# Altium schematic sheet Microcontroller.SchDoc
size A3; ApprovedBy: Enes Mercan; CompanyName: HurSAT; Engineer: Enes Mercan; SheetNumber: 4; SheetTotal: 5; PageSize: A3
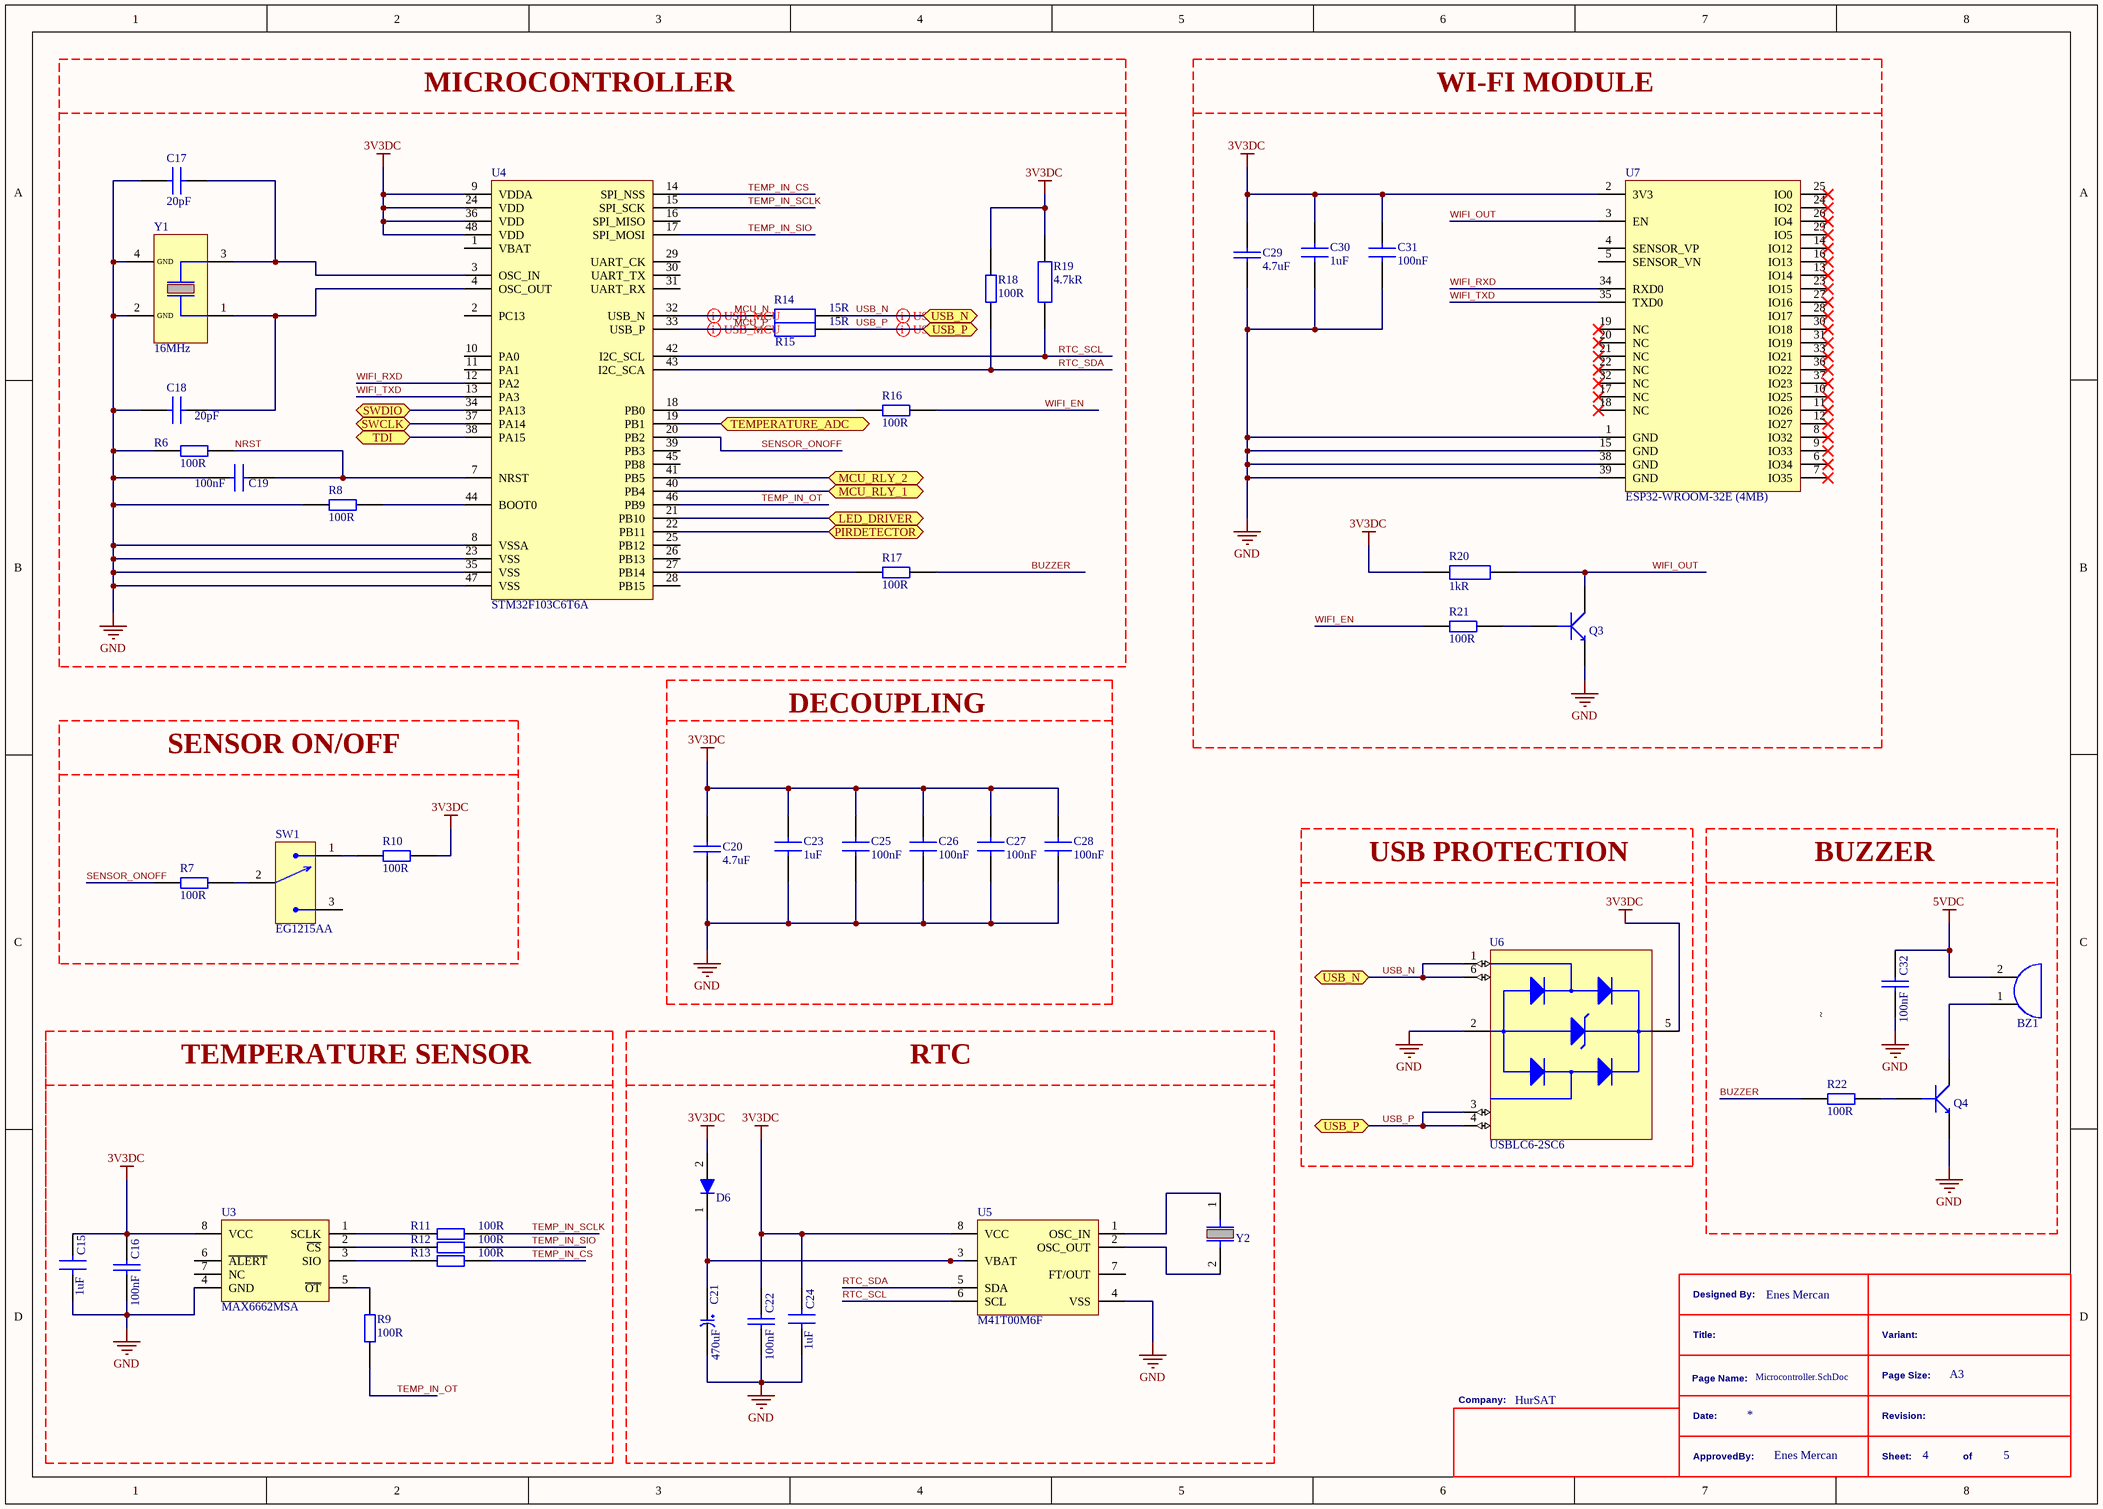
[diagram p0: Microcontroller.SchDoc]

## Parts
BZ1  CMI-9605IC-0580T  [CMI-9605IC-0580T]  (value not drawn)
C15  Capacitance: 1uF  [CAP_0805]  (hidden comment: CL21B105KBFNNNE)
C16  Capacitance: 100nF  [CAP_0805]  (hidden comment: CL21B104KBCNNNC)
C17  Capacitance: 20pF  [cap_0603]  (hidden comment: CL10C200JB8NNNC)
C18  Capacitance: 20pF  [cap_0603]  (hidden comment: CL10C200JB8NNNC)
C19  Capacitance: 100nF  [cap_0603]  (hidden comment: C0603X104K4RACTU)
C20  Capacitance: 4.7uF  [CAP_0805]  (hidden comment: CL21A475KAQNNNE)
C21  Capacitance: 470uF  [CAP_RADIAL_D10P5]  (hidden comment: ESY277M050AH4AA)
C22  Capacitance: 100nF  [CAP_0805]  (hidden comment: CL21B104KBCNNNC)
C23  Capacitance: 1uF  [CAP_0805]  (hidden comment: CL21B105KBFNNNE)
C24  Capacitance: 1uF  [CAP_0805]  (hidden comment: CL21B105KBFNNNE)
C25  Capacitance: 100nF  [cap_0603]  (hidden comment: C0603X104K4RACTU)
C26  Capacitance: 100nF  [cap_0603]  (hidden comment: C0603X104K4RACTU)
C27  Capacitance: 100nF  [cap_0603]  (hidden comment: C0603X104K4RACTU)
C28  Capacitance: 100nF  [cap_0603]  (hidden comment: C0603X104K4RACTU)
C29  Capacitance: 4.7uF  [CAP_0805]  (hidden comment: CL21A475KAQNNNE)
C30  Capacitance: 1uF  [CAP_0805]  (hidden comment: CL21B105KBFNNNE)
C31  Capacitance: 100nF  [cap_0603]  (hidden comment: C0603X104K4RACTU)
C32  Capacitance: 100nF  [CAP_0805]  (hidden comment: CL21B104KBCNNNC)
D6  1N4148WS  [1N4148WS]  (value not drawn)
Q3  MMBT3904-7-F  [MMBT3904-7-F]  (value not drawn)
Q4  MMBT3904-7-F  [MMBT3904-7-F]  (value not drawn)
R6  Resistance: 100R  [res_0603]  (hidden comment: RE0603DRE07100RL)
R7  Resistance: 100R  [res_0603]  (hidden comment: RE0603DRE07100RL)
R8  Resistance: 100R  [res_0603]  (hidden comment: RE0603DRE07100RL)
R9  Resistance: 100R  [res_0603]  (hidden comment: RE0603DRE07100RL)
R10  Resistance: 100R  [res_0603]  (hidden comment: RE0603DRE07100RL)
R11  Resistance: 100R  [res_0603]  (hidden comment: RE0603DRE07100RL)
R12  Resistance: 100R  [res_0603]  (hidden comment: RE0603DRE07100RL)
R13  Resistance: 100R  [res_0603]  (hidden comment: RE0603DRE07100RL)
R14  Resistance: 15R  [res_0603]  (hidden comment: RT0603WRE0715RL)
R15  Resistance: 15R  [res_0603]  (hidden comment: RT0603WRE0715RL)
R16  Resistance: 100R  [res_0603]  (hidden comment: RE0603DRE07100RL)
R17  Resistance: 100R  [res_0603]  (hidden comment: RE0603DRE07100RL)
R18  Resistance: 100R  [res_0603]  (hidden comment: RE0603DRE07100RL)
R19  Resistance: 4.7kR  [res_0603]  (hidden comment: RT0603BRB074K7L)
R20  Resistance: 1kR  [res_0603]  (hidden comment: AC0603FR-071KL)
R21  Resistance: 100R  [res_0603]  (hidden comment: RE0603DRE07100RL)
R22  Resistance: 100R  [res_0603]  (hidden comment: RE0603DRE07100RL)
SW1  EG1215AA  [EG1215AA]
U3  MAX6662MSA  [SOIC8]
U4  STM32F103C6T6A  [LQFP-48]
U5  M41T00M6F  [SOIC8]
U6  USBLC6-2SC6  [SOT23-6L]
U7  ESP32-WROOM-32E (4MB)  [ESP32-32E]
Y1  Frequency: 16MHz  [ECS]  (hidden comment: ECS-160-20-30B-TR)
Y2  CRYSTAL_32768KHZ  [ABS05]  (value not drawn)

## Blocks framed on the sheet
MICROCONTROLLER: C17-C19 R6 R8 R14-R19 U4 Y1
WI-FI MODULE: C29-C31 Q3 R20 R21 U7
DECOUPLING: C20 C23 C25-C28
SENSOR ON/OFF: R7 R10 SW1
USB PROTECTION: U6
BUZZER: BZ1 C32 Q4 R22
RTC: C21 C22 C24 D6 U5 Y2

## Ports
LED_DRIVER (bidir), MCU_RLY_1 (bidir), MCU_RLY_2 (bidir), PIRDETECTOR (bidir), SWCLK (bidir), SWDIO (bidir), TDI (bidir), TEMPERATURE_ADC (bidir), USB_N (bidir), USB_P (bidir)

## Nets
3V3DC: C15.2 C16.2 C20.2 C22.2 C23.2 C24.2 C25.2 C26.2 C27.2 C28.2 C29.2 C30.2 C31.2 D6.2 R10.2 R18.2 R19.2 R20.1 U3.8(VCC) U4.9(VDDA) U4.24(VDD) U4.36(VDD) U4.48(VDD) U5.8(VCC) U6.5(VBUS) U7.2(3V3)
5VDC: BZ1.2 C32.2
GND: C15.1 C16.1 C17.1 C18.1 C19.2 C20.1 C21.2 C22.1 C23.1 C24.1 C25.1 C26.1 C27.1 C28.1 C29.1 C30.1 C31.1 C32.1 Q3.E Q4.E R6.1 R8.1 U3.4(GND) U4.8(VSSA) U4.23(VSS) U4.35(VSS) U4.47(VSS) U5.4(VSS) U6.2(GND) U7.1(GND) U7.15(GND) U7.38(GND) U7.39(GND) Y1.2(GND) Y1.4(GND)
BUZZER: R17.2 R22.1
LED_DRIVER: U4.21(PB10) ; port LED_DRIVER
MCU_N: R14.1 U4.32(USB_N)
MCU_P: R15.1 U4.33(USB_P)
MCU_RLY_1: U4.40(PB4) ; port MCU_RLY_1
MCU_RLY_2: U4.41(PB5) ; port MCU_RLY_2
NRST: C19.1 R6.2 U4.7(NRST)
PIRDETECTOR: U4.22(PB11) ; port PIRDETECTOR
RTC_SCL: R19.1 U4.42(I2C_SCL) U5.6(SCL)
RTC_SDA: R18.1 U4.43(I2C_SCA) U5.5(SDA)
SENSOR_ONOFF: R7.1 U4.20(PB2)
SWCLK: U4.37(PA14) ; port SWCLK
SWDIO: U4.34(PA13) ; port SWDIO
TDI: U4.38(PA15) ; port TDI
TEMP_IN_CS: R13.2 U4.14(SPI_NSS)
TEMP_IN_OT: R9.2 U4.46(PB9)
TEMP_IN_SCLK: R11.2 U4.15(SPI_SCK)
TEMP_IN_SIO: R12.2 U4.17(SPI_MOSI)
TEMPERATURE_ADC: U4.19(PB1) ; port TEMPERATURE_ADC
USB_N: R14.2 U6.1(I/O1) U6.6(I/O1) ; port USB_N
USB_P: R15.2 U6.3(I/O2) U6.4(I/O2) ; port USB_P
WIFI_EN: R16.2 R21.1
WIFI_OUT: Q3.C R20.2 U7.3(EN)
WIFI_RXD: U4.12(PA2) U7.34(RXD0)
WIFI_TXD: U4.13(PA3) U7.35(TXD0)
NetBZ1_1: BZ1.1 Q4.C
NetC17_2: C17.2 U4.3(OSC_IN) Y1.3
NetC18_2: C18.2 U4.4(OSC_OUT) Y1.1
NetC21_1: C21.1 D6.1 U5.3(VBAT)
NetQ3_B: Q3.B R21.2
NetQ4_B: Q4.B R22.2
NetR7_2: R7.2 SW1.2
NetR8_2: R8.2 U4.44(BOOT0)
NetR9_1: R9.1 U3.5(~{OT})
NetR10_1: R10.1 SW1.1
NetR11_1: R11.1 U3.1(SCLK)
NetR12_1: R12.1 U3.2(~{CS})
NetR13_1: R13.1 U3.3(SIO)
NetR16_1: R16.1 U4.18(PB0)
NetR17_1: R17.1 U4.27(PB14)
NetU5_1: U5.1(OSC_IN) Y2.1
NetU5_2: U5.2(OSC_OUT) Y2.2

Not connected (* = marked no-connect by the designer): SW1 3; U3 6(~{ALERT}) 7(NC); U4 1(VBAT) 2(PC13) 10(PA0) 11(PA1) 16(SPI_MISO) 25(PB12) 26(PB13) 28(PB15) 29(UART_CK) 30(UART_TX) 31(UART_RX) 39(PB3) 45(PB8); U5 7(FT/OUT); U7 4(SENSOR_VP) 5(SENSOR_VN) 6(IO34)* 7(IO35)* 8(IO32)* 9(IO33)* 10(IO25)* 11(IO26)* 12(IO27)* 13(IO14)* 14(IO12)* 16(IO13)* 17(NC)* 18(NC)* 19(NC)* 20(NC)* 21(NC)* 22(NC)* 23(IO15)* 24(IO2)* 25(IO0)* 26(IO4)* 27(IO16)* 28(IO17)* 29(IO5)* 30(IO18)* 31(IO19)* 32(NC)* 33(IO21)* 36(IO22)* 37(IO23)*

## Layout directives
differential pair: MCU_N, MCU_P, USB_N, USB_P

## Notes on the sheet
- TEMPERATURE SENSOR
- ~
- Designed By:
- Page Name:
- Title:
- Variant:
- Page Size:
- Company:
- ApprovedBy:
- Date:
- Sheet:
- Revision:
- of

## Library data of the parts
BZ1 = CMI-9605IC-0580T: Buzzers Indicator, Internally Driven Magnetic 5 V 30mA 2.7kHz 80dB @ 5V, 10cm Through Hole PC Pins; Manufacturer: CUI Devices; designedBy: ENES; Supplier 1: Digi-Key; Manufacturer Part Number: CMI-9605IC-0580T; RoHS: No; Stock 1: 1487; Pricing 1: 1=1.56000, 10=1.17900, 25=1.09080, 50=1.02680, 100=0.96490, 500=0.83018, 1000=0.77805 (USD); Supplier Part Number 1: 2223-CMI-9605IC-0580T-ND; Case/Package: CMI-9605IC
C15 C23 C24 C30 = CAP CER 1uF 0805: SAMSUNG ELECTRO-MECHANICS - CL21B105KBFNNNE - SMD Multilayer Ceramic Capacitor, 1 µF, 50 V, 0805 [2012 Metric], ± 10%, X7R, CL Series; Voltage Rating: 50V; Supplier 1: Newark; Manufacturer: Samsung; Manufacturer Part Number: CL21B105KBFNNNE; RoHS: Yes; Category: Ceramic Capacitors; Stock 1: 742; Pricing 1: 1=0.16300, 10=0.11300, 25=0.08900, 50=0.06400, 100=0.05300 (USD); Mount: Surface Mount; Case/Package: 0805; Case Code (Metric): 2012; Case Code (Imperial): 0805; Min Operating Temperature: -55°C; Max Operating Temperature: 125°C; Tolerance: 10%; Packaging: Tape and Reel; Package Quantity: 1; Dielectric: X7R; Voltage: 50V; Series: CL; Construction: Flat; Length: 2mm; Width: 0.049inch; Height: 1.25mm; Thickness: 0.053inch; Depth: 1.25mm; Radiation Hardening: No; RoHS Compliant: Yes; ComponentLink1URL: https://datasheet.ciiva.com/25800/cl21b105kbfnnne-25800291.pdf?src-supplier=Digi-Key; ComponentLink1Description: https://datasheet.ciiva.com/25800/cl21b105kbfnnne-25800291.pdf?src-supplier=Digi-Key; ComponentLink2URL: https://datasheet.ciiva.com/16449/cl21b105kbfnnne-16449003.pdf?src-supplier=Future+Electronics; ComponentLink2Description: https://datasheet.ciiva.com/16449/cl21b105kbfnnne-16449003.pdf?src-supplier=Future+Electronics; ComponentLink3URL: https://datasheet.ciiva.com/26838/getdatasheetpartid-354075-26838668.pdf?src-supplier=Verical; ComponentLink3Description: https://datasheet.ciiva.com/26838/getdatasheetpartid-354075-26838668.pdf?src-supplier=Verical; Supplier Part Number 1: 82AC9435
C16 C22 C32 = CAP CER 100nF  0805: CAP CER %10 0805; Manufacturer: Samsung; Material: Ceramic; Tolerance: 10%; Dielectric: X7R; Voltage Rating: 50V; Supplier 1: Digi-Key; Manufacturer Part Number: CL21B104KBCNNNC; RoHS: Yes; Category: Ceramic Capacitors; Stock 1: 1183365; Pricing 1: 1=0.10000, 10=0.04900, 50=0.02680, 100=0.02190, 500=0.01566, 1000=0.01230 (USD); Mount: Surface Mount; Case/Package: 0805; Case Code (Metric): 2012; Case Code (Imperial): 0805; Contact Plating: Tin; Min Operating Temperature: -55°C; Max Operating Temperature: 125°C; Packaging: Tape and Reel; Voltage: 50V; Voltage Rating (DC): 50V; Series: CL; Construction: Flat; Length: 2mm; Width: 0.049inch; Height: 0.85mm; Depth: 1.25mm; Thickness: 0.037inch; Radiation Hardening: No; Lead Free: Lead Free; RoHS Compliant: Yes; ComponentLink1URL: https://datasheet.ciiva.com/25710/cl21b104kbcnnnc-25710182.pdf?src-supplier=Digi-Key; ComponentLink1Description: https://datasheet.ciiva.com/25710/cl21b104kbcnnnc-25710182.pdf?src-supplier=Digi-Key; ComponentLink2URL: https://datasheet.ciiva.com/29199/454152-da-01-en-vs-kondensator-0805-29199814.pdf?src-supplier=Conrad; ComponentLink2Description: https://datasheet.ciiva.com/29199/454152-da-01-en-vs-kondensator-0805-29199814.pdf?src-supplier=Conrad; Supplier Part Number 1: 1276-1003-1-ND
C17 C18 = CAP CER 20pF: SAMSUNG ELECTRO-MECHANICS - CL10C200JB8NNNC - SMD Multilayer Ceramic Capacitor, 20 pF, 50 V, 0603 [1608 Metric], ± 5%, C0G / NP0, CL Series; Voltage Rating: 50V; Temperature Coefficient: 300ppm/°C; Supplier 1: Digi-Key; Manufacturer: Samsung; Manufacturer Part Number: CL10C200JB8NNNC; RoHS: Yes; Category: Ceramic Capacitors; Stock 1: 669806; Pricing 1: 1=0.10000, 10=0.04900, 50=0.02680, 100=0.02180, 500=0.01558, 1000=0.01224 (USD); Mount: Surface Mount; Case/Package: 0603; Case Code (Metric): 1608; Case Code (Imperial): 0603; Min Operating Temperature: -55°C; Max Operating Temperature: 125°C; Tolerance: 5%; Dielectric: C0G; Package Quantity: 1; Packaging: Tape and Reel; Voltage: 50V; Series: CL; Construction: Flat; Length: 1.6mm; Width: 0.031inch; Height: 0.8mm; Thickness: 0.035inch; Depth: 0.8mm; Radiation Hardening: No; RoHS Compliant: Yes; ComponentLink1URL: https://datasheet.ciiva.com/26877/getdatasheetpartid-640634-26877974.pdf?src-supplier=Verical; ComponentLink1Description: https://datasheet.ciiva.com/26877/getdatasheetpartid-640634-26877974.pdf?src-supplier=Verical; ComponentLink2URL: https://datasheet.ciiva.com/26310/mlcc-catalogdownload2013-eng-26310315.pdf?src-supplier=Distrelec; ComponentLink2Description: https://datasheet.ciiva.com/26310/mlcc-catalogdownload2013-eng-26310315.pdf?src-supplier=Distrelec; Supplier Part Number 1: 1276-1187-1-ND
C19 C25-C28 C31 = CAP CER 100nF  0603: CAP CER 0.1UF 16V X7R 0603; Manufacturer: KEMET; Dielectric Material: Ceramic; Tolerance: 10%; Dissipation Factor: 3.5%; designedBy: ENES; Supplier 1: Digi-Key; Manufacturer Part Number: C0603X104K4RACTU; RoHS: Yes; Category: Ceramic Capacitors; Stock 1: 7802; Pricing 1: 1=0.42000, 10=0.28900, 50=0.20220, 100=0.17320, 500=0.12994, 1000=0.10972 (USD); Mount: Surface Mount,PCB; Case/Package: 0603; Number of Pins: 2; Case Code (Metric): 1608; Case Code (Imperial): 0603; Min Operating Temperature: -55°C; Max Operating Temperature: 125°C; Package Quantity: 4000; Voltage Rating: 16V; Packaging: Tape and Reel; Voltage Rating (DC): 16V; Dielectric: X7R; Termination: SMD/SMT; Voltage: 16V; Features: Soft Termination; Length: 1.6mm; Width: 0.8mm; Height: 0.8mm; Thickness: 0.034inch; Depth: 0.8mm; Radiation Hardening: No; REACH SVHC: No SVHC; ComponentLink1URL: https://datasheet.ciiva.com/14597/70096394-14597397.pdf?src-supplier=Allied+Electronics; ComponentLink1Description: https://datasheet.ciiva.com/14597/70096394-14597397.pdf?src-supplier=Allied+Electronics; ComponentLink2URL: https://datasheet.ciiva.com/14594/70096394-14594795.pdf?src-supplier=Allied+Electronics; ComponentLink2Description: https://datasheet.ciiva.com/14594/70096394-14594795.pdf?src-supplier=Allied+Electronics; Supplier Part Number 1: 399-5344-1-ND
C20 C29 = CAP CER 4.7uF 0805: CAP CER 4.7uF %10 0805; Manufacturer: Samsung; Tolerance: 10%; Voltage Rating: 25V; Dielectric: X5R; Supplier 1: Arrow Electronics; Manufacturer Part Number: CL21A475KAQNNNE; RoHS: Yes; Category: Ceramic Capacitors; Stock 1: 28; Pricing 1: 1=0.09310, 10=0.05730, 25=0.05670 (USD); Mount: Surface Mount; Case/Package: 0805; Case Code (Metric): 2012; Case Code (Imperial): 0805; Min Operating Temperature: -55°C; Max Operating Temperature: 85°C; Package Quantity: 1; Packaging: Tape and Reel; Voltage Rating (DC): 25V; Series: CL; Construction: Flat; Length: 2mm; Width: 0.049inch; Height: 1.25mm; Thickness: 0.055inch; Depth: 1.25mm; Radiation Hardening: No; Lead Free: Lead Free; RoHS Compliant: Yes; ComponentLink1URL: https://datasheet.ciiva.com/25798/cl21a475kaqnnne-25798882.pdf?src-supplier=Digi-Key; ComponentLink1Description: https://datasheet.ciiva.com/25798/cl21a475kaqnnne-25798882.pdf?src-supplier=Digi-Key; Supplier Part Number 1: CL21A475KAQNNNE
C21 = CAP ALU ELEC 470uF: Cap, 470UF, 50V, Alu Elec, Radial; Manufacturer: KEMET; Manufacturer Part Number: ESH477M050AH4AA; Polarity: Polar; Tolerance: 20%; Life (Hours): 2000Hour; Supplier 1: Digi-Key; RoHS: No; Pricing 1: 1=0.59000, 10=0.41700, 50=0.31540, 100=0.27470, 500=0.20350, 1000=0.17298, 2500=0.16280, 5000=0.15262 (USD); Mount: Through Hole; Case/Package: Radial; Min Operating Temperature: -40°C; Max Operating Temperature: 105°C; Packaging: Bulk; Voltage Rating: 50V; RoHS Compliant: No; ComponentLink1URL: https://api.kemet.com/component-edge/download/datasheet/ESH477M050AH4AA.pdf?src-supplier=Digi-Key; ComponentLink1Description: https://api.kemet.com/component-edge/download/datasheet/ESH477M050AH4AA.pdf?src-supplier=Digi-Key; Supplier Part Number 1: 399-15683-ND
D6 = 1N4148WS: ON SEMICONDUCTOR - 1N4148WS - Small Signal Diode, Single, 75 V, 150 mA, 1 V, 4 ns; Manufacturer: ON Semiconductor / Fairchild; Forward Current: 150mA; Max Repetitive Reverse Voltage (Vrrm): 75V; Reverse Recovery Time: 4ns; Forward Voltage: 1V; Max Reverse Current: 5uA; Power Dissipation: 200mW; Max Forward Surge Current (Ifsm): 2A; Supplier 1: Digi-Key; Manufacturer Part Number: 1N4148WS; RoHS: Yes; Category: Rectifier Diodes; Stock 1: 462441; Pricing 1: 1=0.18000, 10=0.16700, 100=0.09090, 500=0.05596, 1000=0.03816 (USD); Mount: Surface Mount; Number of Pins: 2; Contact Plating: Tin,Matte; Weight: 0.0276g; Min Operating Temperature: -55°C; Max Operating Temperature: 150°C; Packaging: Tape and Reel; Element Configuration: Single; Package Quantity: 1; Average Rectified Current: 150mA; Max Reverse Voltage (DC): 75V; Recovery Time: 4ns; Series: -; Reverse Voltage: 75V; Length: 1.8mm; Width: 1.35mm; Height: 1mm; Radiation Hardening: No; RoHS Compliant: Yes; REACH SVHC: No SVHC; Lead Free: Lead Free; ComponentLink1URL: https://datasheet.ciiva.com/25968/1n914bws-25968945.pdf?src-supplier=Avnet+Europe; ComponentLink1Description: https://datasheet.ciiva.com/25968/1n914bws-25968945.pdf?src-supplier=Avnet+Europe; ComponentLink2URL: https://datasheet.ciiva.com/30479/0900766b810e1cd3-30479206.pdf?src-supplier=RSComponents; ComponentLink2Description: https://datasheet.ciiva.com/30479/0900766b810e1cd3-30479206.pdf?src-supplier=RSComponents; ComponentLink3URL: https://datasheet.ciiva.com/8300/1n914bws-8300360.pdf?src-supplier=Avnet; ComponentLink3Description: https://datasheet.ciiva.com/8300/1n914bws-8300360.pdf?src-supplier=Avnet; ComponentLink4URL: https://datasheet.ciiva.com/15208/getdatasheetpartid-127819-15208358.pdf?src-supplier=Verical; ComponentLink4Description: https://datasheet.ciiva.com/15208/getdatasheetpartid-127819-15208358.pdf?src-supplier=Verical; ComponentLink5URL: https://datasheet.ciiva.com/910/1n4148ws-910381.pdf?src-supplier=Digi-Key; ComponentLink5Description: https://datasheet.ciiva.com/910/1n4148ws-910381.pdf?src-supplier=Digi-Key; ComponentLink6URL: https://datasheet.ciiva.com/910/1n4148ws-910382.pdf?src-supplier=Digi-Key; ComponentLink6Description: https://datasheet.ciiva.com/910/1n4148ws-910382.pdf?src-supplier=Digi-Key; ComponentLink7URL: https://datasheet.ciiva.com/910/1n4148ws-910380.pdf?src-supplier=Digi-Key; ComponentLink7Description: https://datasheet.ciiva.com/910/1n4148ws-910380.pdf?src-supplier=Digi-Key; Supplier Part Number 1: 1N4148WSFSCT-ND
Q3 Q4 = MMBT3904-7-F: Transistor General Purpose BJT NPN 40 Volt 0.2A Automotive 3-Pin SOT-23; Manufacturer: Diodes Zetex; Max Power Dissipation: 300mW; Collector Emitter Voltage (VCEO): 40V; Max Collector Current: 200mA; Collector Base Voltage (VCBO): 60V; Frequency: 300MHz; hFE Min: 100; Number of Elements: 1; Emitter Base Voltage (VEBO): 6V; Collector Emitter Saturation Voltage: 300mV; Power Dissipation: 350mW; Element Configuration: Single; Supplier 1: RSComponents; Manufacturer Part Number: MMBT3904-7-F; RoHS: Yes; Category: BJTs; Stock 1: 66000; Pricing 1: 200=0.04800, 1000=0.03300, 2000=0.03000, 5000=0.01600, 10000=0.01600 (USD); Mount: Surface Mount; Case/Package: SOT-23; Number of Pins: 3; Weight: 0.000282oz; Contact Plating: Tin,Matte; Min Operating Temperature: -55°C; Max Operating Temperature: 150°C; Polarity: NPN; Packaging: Tape and Reel; Package Quantity: 3000; Transition Frequency: 300MHz; Collector Emitter Breakdown Voltage: 40V; Max Breakdown Voltage: 40V; Continuous Collector Current: 200mA; Max Frequency: 300MHz; Gain Bandwidth Product: 300MHz; Series: -; Collector-emitter Voltage-Max: 300mV; Voltage Rating (DC): 40V; Length: 3.05mm; Width: 1.4mm; Height: 1mm; Radiation Hardening: No; REACH SVHC: No SVHC; Lead Free: Lead Free; RoHS Compliant: Yes; ComponentLink1URL: https://datasheet.ciiva.com/11201/ds30036-11201778.pdf?src-supplier=Avnet; ComponentLink1Description: https://datasheet.ciiva.com/11201/ds30036-11201778.pdf?src-supplier=Avnet; ComponentLink2URL: https://datasheet.ciiva.com/15138/getdatasheetpartid-53265-15138780.pdf?src-supplier=Verical; ComponentLink2Description: https://datasheet.ciiva.com/15138/getdatasheetpartid-53265-15138780.pdf?src-supplier=Verical; ComponentLink3URL: https://datasheet.ciiva.com/6361/ds30036-6361254.pdf?src-supplier=Digi-Key; ComponentLink3Description: https://datasheet.ciiva.com/6361/ds30036-6361254.pdf?src-supplier=Digi-Key; ComponentLink4URL: https://datasheet.ciiva.com/22711/1915516-22711750.pdf?src-supplier=Element14; ComponentLink4Description: https://datasheet.ciiva.com/22711/1915516-22711750.pdf?src-supplier=Element14; ComponentLink5URL: https://datasheet.ciiva.com/11198/ds30036-11198999.pdf?src-supplier=Avnet; ComponentLink5Description: https://datasheet.ciiva.com/11198/ds30036-11198999.pdf?src-supplier=Avnet; ComponentLink6URL: https://datasheet.ciiva.com/6361/ds30036-6361256.pdf?src-supplier=Digi-Key; ComponentLink6Description: https://datasheet.ciiva.com/6361/ds30036-6361256.pdf?src-supplier=Digi-Key; Supplier Part Number 1: 7385049P
R6-R13 R16-R18 R21 R22 = RES 100 OHM 0603: Chip Resistor Precision Grade Thick Film 0603 100Ohm 0.5% Paper T/R; Manufacturer: Yageo; Max Power Dissipation: 100mW; Temperature Coefficient: 50ppm/°C; Supplier 1: Digi-Key; Manufacturer Part Number: RE0603DRE07100RL; RoHS: Yes; Category: Chip SMD Resistors; Pricing 1: 5000=0.01210 (USD); Case/Package: 0603; Min Operating Temperature: -55°C; Max Operating Temperature: 155°C; Packaging: Tape and Reel; Resistor Type: Thick Film; Number of Terminations: 2; Tolerance: 0.5%; Features: Moisture Resistant; Length: 0.063inch; Width: 0.032inch; Height: 0.022inch; RoHS Compliant: Yes; ComponentLink1URL: http://www.yageo.com/NewPortal/yageodocoutput?fileName=/pdf/R-Chip/PYu-RE_105_RoHS_L_6.pdf&src-supplier=Digi-Key; ComponentLink1Description: http://www.yageo.com/NewPortal/yageodocoutput?fileName=/pdf/R-Chip/PYu-RE_105_RoHS_L_6.pdf&src-supplier=Digi-Key; Supplier Part Number 1: RE0603DRE07100RL-ND
R14 R15 = RES 15 OHM 0603: RES SMD 15 OHM 0.05% 1/10W 0603; Manufacturer: Yageo; Max Power Dissipation: 100mW; Temperature Coefficient: 50ppm/°C; Supplier 1: Digi-Key; Manufacturer Part Number: RT0603WRE0715RL; RoHS: Yes; Category: Chip SMD Resistors; Pricing 1: 5000=0.08031 (USD); Case/Package: 0603; Min Operating Temperature: -55°C; Max Operating Temperature: 155°C; Packaging: Tape and Reel; Resistor Type: Thin Film; Number of Terminations: 2; Tolerance: 0.05%; Features: Moisture Resistant; Length: 0.063inch; Width: 0.031inch; Height: 0.022inch; RoHS Compliant: Yes; ComponentLink1URL: http://www.yageo.com/documents/recent/PYu-RT_1-to-0.01_RoHS_L_8.pdf?src-supplier=Digi-Key; ComponentLink1Description: http://www.yageo.com/documents/recent/PYu-RT_1-to-0.01_RoHS_L_8.pdf?src-supplier=Digi-Key; Supplier Part Number 1: RT0603WRE0715RL-ND
R19 = RES 4K7 OHM 0603: Res Thin Film 0603 4.7K Ohm 0.1% 0.1W(1/10W) ±10ppm/C Molded SMD Paper T/R; Manufacturer: Yageo; Voltage Rating: 75V; Power Rating: 100mW; Temperature Coefficient: 10ppm/°C; Supplier 1: Digi-Key; Manufacturer Part Number: RT0603BRB074K7L; RoHS: Yes; Category: Chip SMD Resistors; Stock 1: 6694; Pricing 1: 1=0.60000, 10=0.44100, 100=0.25710, 1000=0.14419, 2500=0.13920 (USD); Case/Package: 0603; Case Code (Metric): 1608; Case Code (Imperial): 0603; Min Operating Temperature: -55°C; Max Operating Temperature: 125°C; Tolerance: 0.1%; Packaging: Tape and Reel; Resistor Type: Thin Film; Number of Terminations: 2; Termination: SMD/SMT; Max Power Dissipation: 100mW; Features: Moisture Resistant; Series: RT; Construction: Rectangular; Length: 0.063inch; Width: 0.031inch; Height: 0.022inch; Depth: 0.8mm; Military Standard: Not; RoHS Compliant: Yes; ComponentLink1URL: https://datasheet.ciiva.com/12721/pyu-rt-1-to-0-05-rohs-l-4-12721239.pdf?src-supplier=Mouser; ComponentLink1Description: https://datasheet.ciiva.com/12721/pyu-rt-1-to-0-05-rohs-l-4-12721239.pdf?src-supplier=Mouser; Supplier Part Number 1: YAG4447CT-ND
R20 = RES 1K OHM 0603: Res Thick Film 0603 1K Ohm 1% 0.1W(1/10W) ±100ppm/C Epoxy Pad SMD Automotive T/R; Manufacturer: Yageo; Power Rating: 100mW; Voltage Rating: 50V; Temperature Coefficient: 100ppm/°C; Supplier 1: Digi-Key; Manufacturer Part Number: AC0603FR-071KL; RoHS: Yes; Category: Chip SMD Resistors; Stock 1: 861; Pricing 1: 1=0.10000, 10=0.02900, 100=0.01170, 1000=0.00527, 2500=0.00458 (USD); Case/Package: 0603; Case Code (Metric): 1608; Case Code (Imperial): 0603; Size Code: 0603; Min Operating Temperature: -55°C; Max Operating Temperature: 155°C; Tolerance: 1%; Packaging: Tape and Reel; Package Quantity: 1; Resistor Type: Thick Film; Number of Terminations: 2; Termination: SMD/SMT; Max Power Dissipation: 100mW; Features: Moisture Resistant,Automotive AEC-Q200,Anti-Sulfur; Series: AC; Construction: Rectangular; Length: 0.063inch; Width: 0.031inch; Height: 0.022inch; Depth: 0.8mm; Military Standard: Not; Lead Free: Lead Free; RoHS Compliant: Yes; ComponentLink1URL: https://datasheet.ciiva.com/5558/pyu-ac-51-rohs-l-2-5558269.pdf?src-supplier=Mouser; ComponentLink1Description: https://datasheet.ciiva.com/5558/pyu-ac-51-rohs-l-2-5558269.pdf?src-supplier=Mouser; Supplier Part Number 1: 311-1KLDCT-ND
SW1 = EG1215AA: Slide Switch, SPDT, 0.025A, 24V, SMD; Manufacturer: E-Switch; Mechanical Life: 10000Cycles; Switch Function: On-On; Current Rating: 25mA; Actuator Type: Standard; Switch Travel: 1.5mm; Operating Force: 150gf; Zener Voltage: 9.1V; Tolerance: 4.95%; Max Power Dissipation: 5W; Impedance: 2R; Actuator Length: 1.4mm; designedBy: ENES; Supplier 1: Digi-Key; Manufacturer Part Number: EG1215AA; RoHS: Yes; Pricing 1: 1=0.86000, 10=0.82700, 25=0.77320, 100=0.67130, 250=0.61084, 500=0.56630, 1000=0.52495 (USD); Mount: Surface Mount,Through Hole; Case/Package: Axial; Min Operating Temperature: -20°C; Max Operating Temperature: 175°C; Throw Configuration: SPDT; Packaging: Cut Tape; Voltage Rating (DC): 24V; Termination: Gull Wing; Electrical Life: 10000Cycles; ComponentLink1URL: https://media.digikey.com/pdf/Data%20Sheets/E-Switch%20PDFs/EG1215_Series_Ds.pdf?src-supplier=Digi-Key; ComponentLink1Description: https://media.digikey.com/pdf/Data%20Sheets/E-Switch%20PDFs/EG1215_Series_Ds.pdf?src-supplier=Digi-Key; ComponentLink2URL: http://www.farnell.com/datasheets/2645007.pdf?src-supplier=Farnell; ComponentLink2Description: http://www.farnell.com/datasheets/2645007.pdf?src-supplier=Farnell; Supplier Part Number 1: EG5720CT-ND
U3 = MAX6662MSA: Temp Sensor Digital Serial (3-Wire, SPI) 8-Pin SOIC N Tube; Manufacturer: Maxim; Manufacturer Part Number: MAX6662MSA+; Output Type: Digital,SPI; Max Supply Voltage (DC): 5.5V; Min Supply Voltage (DC): 3V; Resolution: 12b; Max Power Dissipation: 471mW; Operating Supply Current: 600uA; Number of Bits: 12; Supplier 1: Digi-Key; RoHS: Yes; Category: Temperature and Humidity Sensors; Stock 1: 748; Pricing 1: 1=3.20000, 10=2.87000, 25=2.71360, 100=2.35170, 500=2.00196, 1000=1.78220 (USD); Case/Package: SOIC; Number of Pins: 8; Min Operating Temperature: -55°C; Max Operating Temperature: 150°C; Interface: SPI; Packaging: Rail/Tube; Package Quantity: 100; Series: MAX6662; Max Supply Voltage: 5.5V; Min Supply Voltage: 3V; Length: 5mm; Width: 4mm; Height: 1.5mm; Radiation Hardening: No; RoHS Compliant: Yes; Lead Free: Lead Free; REACH SVHC: Unknown; ComponentLink1URL: https://datasheet.ciiva.com/5299/max6662-89142-5299456.pdf?src-supplier=Mouser; ComponentLink1Description: https://datasheet.ciiva.com/5299/max6662-89142-5299456.pdf?src-supplier=Mouser; ComponentLink2URL: https://datasheet.ciiva.com/16635/max6662-16635842.pdf?src-supplier=Avnet+Europe; ComponentLink2Description: https://datasheet.ciiva.com/16635/max6662-16635842.pdf?src-supplier=Avnet+Europe; ComponentLink3URL: https://datasheet.ciiva.com/3277/max6662-3277979.pdf?src-supplier=Avnet; ComponentLink3Description: https://datasheet.ciiva.com/3277/max6662-3277979.pdf?src-supplier=Avnet; ComponentLink4URL: https://datasheet.ciiva.com/2003/max6662-2003390.pdf?src-supplier=Digi-Key; ComponentLink4Description: https://datasheet.ciiva.com/2003/max6662-2003390.pdf?src-supplier=Digi-Key; Supplier Part Number 1: MAX6662MSA+-ND
U4 = STM32F103C6T6A: MCU 32-bit STM32F ARM Cortex M3 RISC 32KB Flash 2.5V/3.3V 48-Pin LQFP Tray; Manufacturer: STMicroelectronics; Number of Timers/Counters: 3; Max Supply Voltage: 3.6V; Frequency: 72MHz; Interface: I2C,SPI,USART; RAM Size: 10KB; Max Power Dissipation: 363mW; Number of I/Os: 37; Min Supply Voltage: 2V; Oscillator Type: Internal; Data Bus Width: 32b; Watchdog Timer: Yes; Peripherals: POR,PWM,WDT,DMA,Temp Sensor,I2C; Number of ADC Channels: 10; Number of SPI Channels: 1; designedBy: Enes; Supplier 1: Digi-Key; Manufacturer Part Number: STM32F103C6T6A; RoHS: Yes; Category: Microcontrollers; Pricing 1: 1=5.07000, 10=4.55000, 25=4.30120, 80=3.72763, 250=3.53648, 500=3.17326, 1000=2.78775 (USD); Case/Package: LQFP; Number of Pins: 48; Weight: 0.006409oz; Min Operating Temperature: -40°C; Max Operating Temperature: 85°C; Package Quantity: 1500; Packaging: Tray; Max Frequency: 72MHz; Number of Programmable I/O: 37; Memory Type: FLASH; Memory Size: 32KB; Core Architecture: ARM; Series: STM32F103C6; Number of I2C Channels: 1; Address Bus Width: 32b; Length: 7mm; Width: 7mm; Height: 1.4mm; Radiation Hardening: No; Lead Free: Lead Free; REACH SVHC: No SVHC; RoHS Compliant: Yes; ComponentLink1URL: https://datasheet.ciiva.com/15122/getdatasheetpartid-69879-15122075.pdf?src-supplier=Verical; ComponentLink1Description: https://datasheet.ciiva.com/15122/getdatasheetpartid-69879-15122075.pdf?src-supplier=Verical; ComponentLink2URL: https://datasheet.ciiva.com/14100/pustm-arm-microcont-stm32f103-en-14100507.pdf?src-supplier=Distrelec; ComponentLink2Description: https://datasheet.ciiva.com/14100/pustm-arm-microcont-stm32f103-en-14100507.pdf?src-supplier=Distrelec; Supplier Part Number 1: 497-11515-ND
U5 = M41T00M6F: IC RTC CLK/CALENDAR I2C 8-SOIC; Manufacturer: STMicroelectronics; Logic Function: Clock; Time Format: HH:MM:SS; Max Supply Voltage: 5.5V; Min Supply Voltage: 2V; Non-volatile Memory Size: 8B; Interface: I2C,Serial,2-Wire; Date Format: YY-MM-DD-dd; designedBy: ENES; Supplier 1: Digi-Key; Manufacturer Part Number: M41T00M6F; RoHS: Yes; Category: Memory; Stock 1: 5464; Pricing 1: 1=2.95000, 10=2.64900, 25=2.49880, 100=2.12890, 250=1.99896, 500=1.74908, 1000=1.65008 (USD); Mount: Surface Mount; Case/Package: SOIC; Number of Pins: 8; Weight: 0.019048oz; Min Operating Temperature: -40°C; Max Operating Temperature: 85°C; Packaging: Tape and Reel; Package Quantity: 2500; Memory Size: 8B; RAM Size: 8B; Series: M41T00; Supply Voltage-Nom: 5.5V; Length: 5mm; Width: 4mm; Height: 1.5mm; Radiation Hardening: No; REACH SVHC: No SVHC; Lead Free: Lead Free; Temperature Grade: INDUSTRIAL; RoHS Compliant: Yes; ComponentLink1URL: https://datasheet.ciiva.com/25889/cd00001542-25889923.pdf?src-supplier=Avnet+Europe; ComponentLink1Description: https://datasheet.ciiva.com/25889/cd00001542-25889923.pdf?src-supplier=Avnet+Europe; ComponentLink2URL: https://datasheet.ciiva.com/16213/cd00001542-16213654.pdf?src-supplier=Future+Electronics; ComponentLink2Description: https://datasheet.ciiva.com/16213/cd00001542-16213654.pdf?src-supplier=Future+Electronics; ComponentLink3URL: https://datasheet.ciiva.com/7630/1837112-7630077.pdf?src-supplier=Element14; ComponentLink3Description: https://datasheet.ciiva.com/7630/1837112-7630077.pdf?src-supplier=Element14; ComponentLink4URL: https://datasheet.ciiva.com/41459/001185345-da-01-en-ic-rtc-srl-512kbit-m41t00m6f-soic-8-stm-41459818.pdf?src-supplier=Conrad; ComponentLink4Description: https://datasheet.ciiva.com/41459/001185345-da-01-en-ic-rtc-srl-512kbit-m41t00m6f-soic-8-stm-41459818.pdf?src-supplier=Conrad; Supplier Part Number 1: 497-4697-1-ND
U6 = TVS - USB Protection: TVS DIODE 5.25V 17V SOT23-6; Manufacturer: STMicroelectronics; Direction: Unidirectional,Bidirectional; Capacitance: 3.5pF; Operating Supply Voltage: 1.1V; Number of Bidirectional Channels: 2; Min Breakdown Voltage: 6V; Power Line Protection: Yes; Test Current: 1mA; Leakage Current: 150nA; Peak Pulse Current: 5A; Number of Elements: 1; Working Voltage: 5V; Element Configuration: Dual; Data Rate: 480Mbps; Supplier 1: Newark; Manufacturer Part Number: USBLC6-2SC6; RoHS: Yes; Category: TVS Diodes; Stock 1: 1535; Pricing 1: 1=0.50800, 10=0.44300, 25=0.40100, 50=0.36000, 100=0.31800 (USD); Mount: Surface Mount; Case/Package: SOT-23; Number of Pins: 6; Min Operating Temperature: -40°C; Max Operating Temperature: 125°C; Clamping Voltage: 17V; Packaging: Tape and Reel; Reverse Standoff Voltage: 5.25V; Series: USB; Reverse Breakdown Voltage: 6V; Polarity: Unidirectional,Bidirectional; Clamping Voltage-Max: 17V; Length: 3.05mm; Width: 1.75mm; Depth: 1.75mm; Radiation Hardening: No; Lead Free: Lead Free; RoHS Compliant: Yes; ComponentLink1URL: https://datasheet.ciiva.com/1268/1690354-1268384.pdf?src-supplier=Element14; ComponentLink1Description: https://datasheet.ciiva.com/1268/1690354-1268384.pdf?src-supplier=Element14; ComponentLink2URL: https://datasheet.ciiva.com/4508/cd00050750-113117-4508433.pdf?src-supplier=Mouser; ComponentLink2Description: https://datasheet.ciiva.com/4508/cd00050750-113117-4508433.pdf?src-supplier=Mouser; ComponentLink3URL: https://datasheet.ciiva.com/15143/getdatasheetpartid-148465-15143789.pdf?src-supplier=Verical; ComponentLink3Description: https://datasheet.ciiva.com/15143/getdatasheetpartid-148465-15143789.pdf?src-supplier=Verical; ComponentLink4URL: https://datasheet.ciiva.com/26787/usblc6-2sc6-26787908.pdf?src-supplier=IIIC; ComponentLink4Description: https://datasheet.ciiva.com/26787/usblc6-2sc6-26787908.pdf?src-supplier=IIIC; ComponentLink5URL: https://datasheet.ciiva.com/16200/cd00050750-16200026.pdf?src-supplier=Future+Electronics; ComponentLink5Description: https://datasheet.ciiva.com/16200/cd00050750-16200026.pdf?src-supplier=Future+Electronics; ComponentLink6URL: https://datasheet.ciiva.com/41444/001184109-da-01-en-ic-esd-protecti-usblc6-2sc6-sot-23-6-stm-41444156.pdf?src-supplier=Conrad; ComponentLink6Description: https://datasheet.ciiva.com/41444/001184109-da-01-en-ic-esd-protecti-usblc6-2sc6-sot-23-6-stm-41444156.pdf?src-supplier=Conrad; Supplier Part Number 1: 26M4748; Contact Plating: Tin,Matte; Package Quantity: 3000; Number of Channels: 2; Breakdown Voltage: 6V; Termination: SMD/SMT; ESD Protection: Yes; Max Reverse Leakage Current: 150nA; Max Breakdown Voltage: 6V; Height: 1.3mm; REACH SVHC: No SVHC
U7 = ESP32-WROOM-32E: Manufacturer: Espressif Systems; designedBy: ENES; Supplier 1: Digi-Key; Manufacturer Part Number: ESP32-WROOM-32E(4MB); RoHS: No; Supplier 2: Digi-Key; Supplier Part Number 2: 1965-ESP32-WROOM-32E(4MB)CT-ND
Y1 = CRYSTAL_16MHZ: CRYSTAL 16.0000MHZ 20PF SMD; Manufacturer: ECS International; Frequency Tolerance: 30ppm; ESR (Equivalent Series Resistance): 50R; Frequency Stability: 50ppm; Supplier 1: Digi-Key; Manufacturer Part Number: ECS-160-20-30B-TR; RoHS: Yes; Category: Crystals; Stock 1: 14789; Pricing 1: 1=1.33000, 10=1.26800, 50=1.23900, 100=1.06200, 500=1.03250 (USD); Mount: Surface Mount; Case/Package: SMD/SMT; Min Operating Temperature: -20°C; Max Operating Temperature: 70°C; Package Quantity: 1; Load Capacitance: 20pF; Packaging: Tape and Reel; Tolerance: 50ppm; Termination: SMD/SMT; Series: ECX-53B; Length: 0.197inch; Width: 0.126inch; Height: 0.033inch; Lead Free: Lead Free; RoHS Compliant: Yes; ComponentLink1URL: https://datasheet.ciiva.com/853/ecx-53b-853408.pdf?src-supplier=Digi-Key; ComponentLink1Description: https://datasheet.ciiva.com/853/ecx-53b-853408.pdf?src-supplier=Digi-Key; ComponentLink2URL: https://datasheet.ciiva.com/853/ecx-53b-853406.pdf?src-supplier=Digi-Key; ComponentLink2Description: https://datasheet.ciiva.com/853/ecx-53b-853406.pdf?src-supplier=Digi-Key; ComponentLink3URL: https://datasheet.ciiva.com/853/ecx-53b-853407.pdf?src-supplier=Digi-Key; ComponentLink3Description: https://datasheet.ciiva.com/853/ecx-53b-853407.pdf?src-supplier=Digi-Key; Supplier Part Number 1: XC1120CT-ND
Y2 = CRYSTAL_32768KHZ: ABRACON - ABS05-32.768KHZ-T - Crystal, 32.768 kHz, SMD, 1.6mm x 1mm, 12.5 pF, 20 ppm, ABS05 Series; Manufacturer: ECS International; Manufacturer Part Number: ECS-160-20-30B-TR; Frequency: 16MHz; Frequency Tolerance: 30ppm; Load Capacitance: 20pF; ESR (Equivalent Series Resistance): 50R; Frequency Stability: 50ppm; Series Resistance: 90kR; Supplier 1: Digi-Key; RoHS: Yes; Category: Crystals; Stock 1: 14789; Pricing 1: 1=1.33000, 10=1.26800, 50=1.23900, 100=1.06200, 500=1.03250 (USD); Mount: Surface Mount; Case/Package: SMD/SMT; Min Operating Temperature: -20°C; Max Operating Temperature: 70°C; Package Quantity: 1; Packaging: Tape and Reel; Tolerance: 50ppm; Termination: SMD/SMT; Series: ECX-53B; Length: 0.197inch; Width: 0.126inch; Height: 0.033inch; Lead Free: Lead Free; RoHS Compliant: Yes; ComponentLink1URL: https://datasheet.ciiva.com/853/ecx-53b-853408.pdf?src-supplier=Digi-Key; ComponentLink1Description: https://datasheet.ciiva.com/853/ecx-53b-853408.pdf?src-supplier=Digi-Key; ComponentLink2URL: https://datasheet.ciiva.com/853/ecx-53b-853406.pdf?src-supplier=Digi-Key; ComponentLink2Description: https://datasheet.ciiva.com/853/ecx-53b-853406.pdf?src-supplier=Digi-Key; ComponentLink3URL: https://datasheet.ciiva.com/853/ecx-53b-853407.pdf?src-supplier=Digi-Key; ComponentLink3Description: https://datasheet.ciiva.com/853/ecx-53b-853407.pdf?src-supplier=Digi-Key; Supplier Part Number 1: XC1120CT-ND; Supplier 2: Digi-Key; Stock 2: 50695; Pricing 2: 1=1.16000, 10=1.02500, 50=0.95760, 100=0.84630, 500=0.80180, 1000=0.66816 (USD); Number of Pins: 2; Operating Frequency: 32.768 kHz; Depth: 1mm; Radiation Hardening: No; REACH SVHC: No SVHC; ComponentLink4URL: https://datasheet.ciiva.com/23810/abs05-23810480.pdf?src-supplier=Newark; ComponentLink4Description: https://datasheet.ciiva.com/23810/abs05-23810480.pdf?src-supplier=Newark; ComponentLink5URL: https://datasheet.ciiva.com/6728/abs05-6728949.pdf?src-supplier=Digi-Key; ComponentLink5Description: https://datasheet.ciiva.com/6728/abs05-6728949.pdf?src-supplier=Digi-Key; ComponentLink6URL: https://datasheet.ciiva.com/6728/abs05-6728950.pdf?src-supplier=Digi-Key; ComponentLink6Description: https://datasheet.ciiva.com/6728/abs05-6728950.pdf?src-supplier=Digi-Key; ComponentLink7URL: https://datasheet.ciiva.com/16411/abs05-16411149.pdf?src-supplier=Future+Electronics; ComponentLink7Description: https://datasheet.ciiva.com/16411/abs05-16411149.pdf?src-supplier=Future+Electronics; Supplier Part Number 2: 535-11899-1-ND